# Altium schematic sheet System.SchDoc: System
size A4; Author: Lucas Liaño; Revision: 1; SheetNumber: 1; SheetTotal: 8
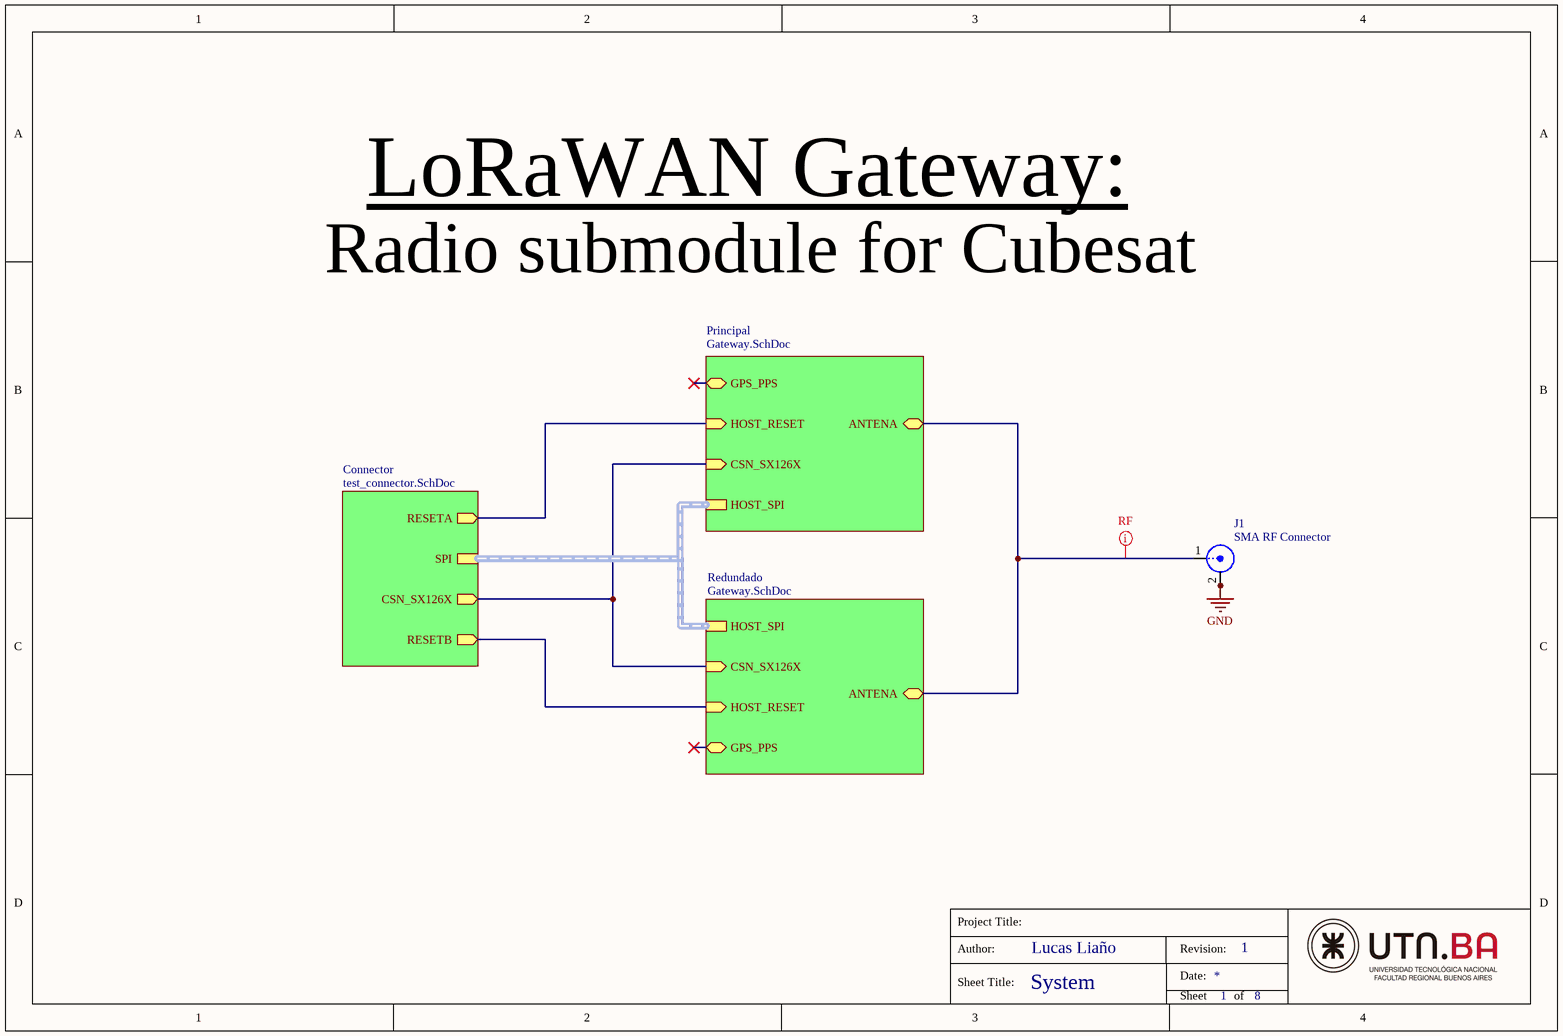
[diagram p0: System.SchDoc]

## Parts
J1  SMA RF Connector  [SMA THT connector]

## Sub-sheets
Connector = test_connector.SchDoc: SPI (harness HOST_SPI), RESETA (out), RESETB (out), CSN_SX126X (out)
Principal = Gateway.SchDoc: GPS_PPS (bidir), HOST_RESET (in), ANTENA (bidir), HOST_SPI (harness HOST_SPI), CSN_SX126X (in)
Redundado = Gateway.SchDoc: ANTENA (bidir), GPS_PPS (bidir), HOST_RESET (in), HOST_SPI (harness HOST_SPI), CSN_SX126X (in)

## Nets
GND: J1.2(GND)
NetJ1_1: J1.1(Signal) ; sheet Principal/ANTENA, sheet Redundado/ANTENA
(unnamed): sheet Principal/HOST_RESET, sheet Connector/RESETA
(unnamed): sheet Principal/CSN_SX126X, sheet Redundado/CSN_SX126X, sheet Connector/CSN_SX126X
(unnamed): sheet Redundado/HOST_RESET, sheet Connector/RESETB

## Buses and harness runs
harness sheet Connector/SPI = sheet Principal/HOST_SPI = sheet Redundado/HOST_SPI

## Layout directives
net class RF: NetJ1_1

## Notes on the sheet
- LoRaWAN Gateway:
- Radio submodule for Cubesat
- Project Title:
- Author:
- Sheet Title:
- Date:
- Revision:
- Sheet
- of

## Library data of the parts
J1 = SMA: SMA 50 Ohm military grade THT connector; Manufacturer: TE Connectivity Aerospace, Defense and Marine; MPN: 1053374-1; Value: SMA female; ComponentLink1Description: Datasheet; ComponentLink1URL: https://www.te.com/commerce/DocumentDelivery/DDEController?Action=srchrtrv&DocNm=1053374&DocType=Customer+Drawing&DocLang=English; ComponentLink2Description: SupplierLink; ComponentLink2URL: https://www.digikey.com/en/products/detail/te-connectivity-aerospace-defense-and-marine/1053374-1/1131391; Package: SMA; Price (USD): 56; Supplier: Digikey